# Altium schematic sheet Sheet1.SchDoc
size A4; SheetNumber: 1; SheetTotal: 1; SPICEModelCacheYBLDTPVB: <root> / <DocumentId>YBLDTPVB</DocumentId> / </root>
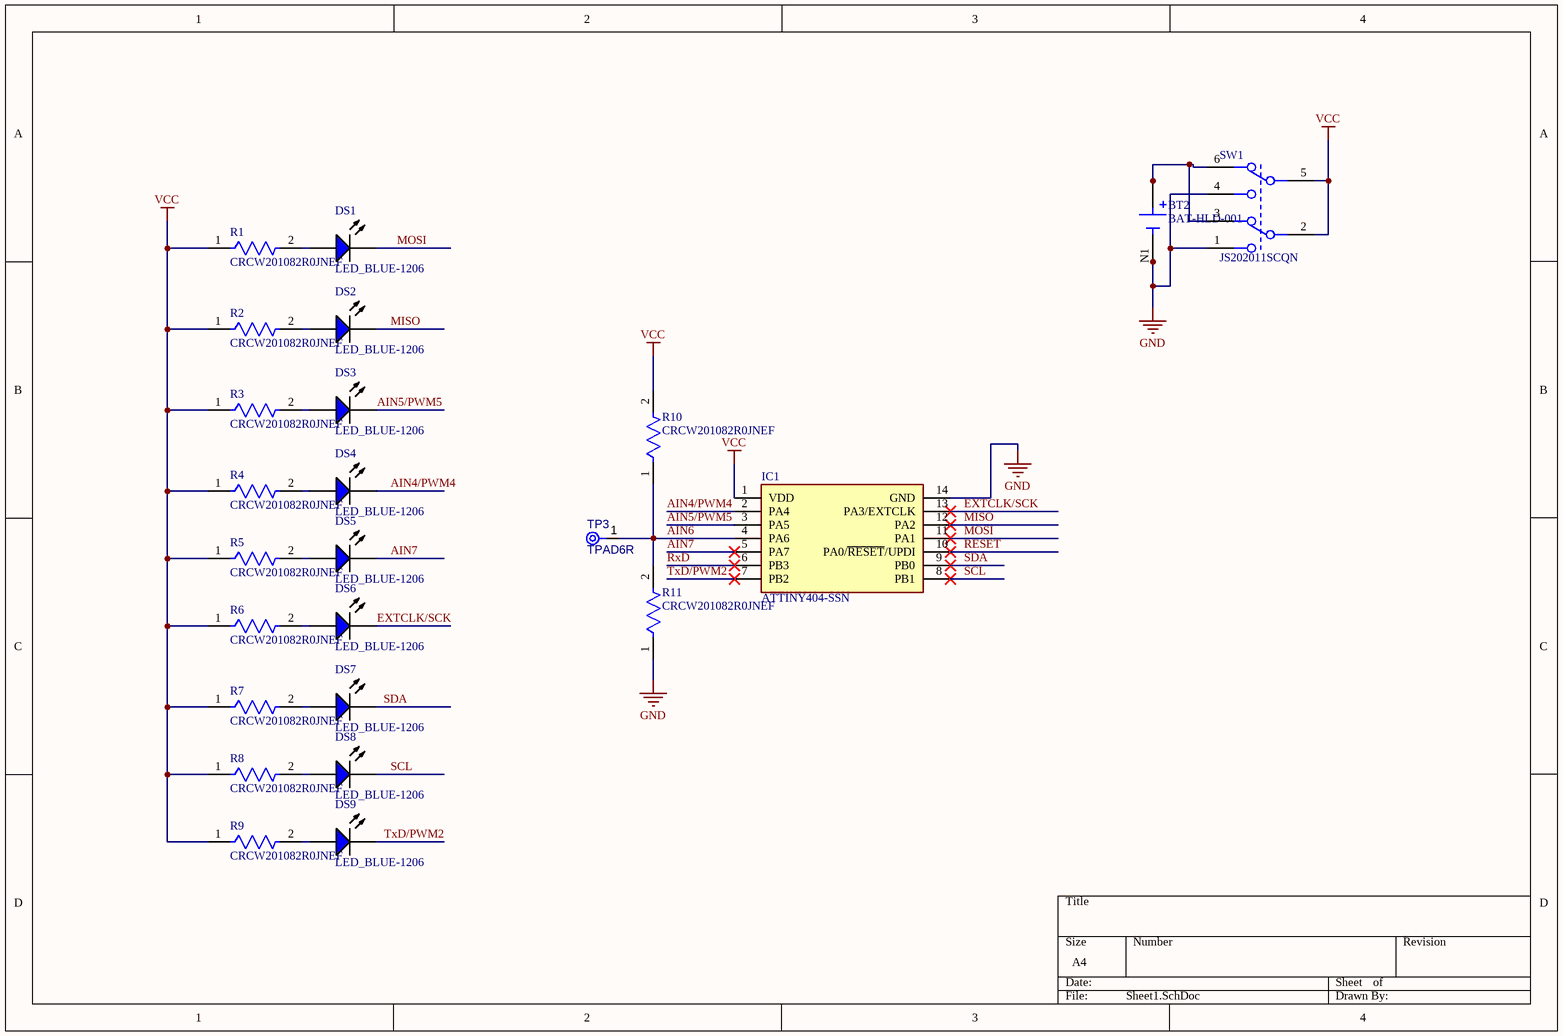
[diagram p0: Sheet1.SchDoc]

## Parts
BT2  BAT-HLD-001  [BAT_BAT-HLD-001]
DS1  LED_BLUE-1206  [LEDC3418X06M]
DS2  LED_BLUE-1206  [LEDC3418X06M]
DS3  LED_BLUE-1206  [LEDC3418X06M]
DS4  LED_BLUE-1206  [LEDC3418X06M]
DS5  LED_BLUE-1206  [LEDC3418X06M]
DS6  LED_BLUE-1206  [LEDC3418X06M]
DS7  LED_BLUE-1206  [LEDC3418X06M]
DS8  LED_BLUE-1206  [LEDC3418X06M]
DS9  LED_BLUE-1206  [LEDC3418X06M]
IC1  ATTINY404-SSN  [SOIC127P600X175-14N]
R1  CRCW201082R0JNEF  [FP-CRCW2010-e3-IPC_A]
R2  CRCW201082R0JNEF  [FP-CRCW2010-e3-IPC_A]
R3  CRCW201082R0JNEF  [FP-CRCW2010-e3-IPC_A]
R4  CRCW201082R0JNEF  [FP-CRCW2010-e3-IPC_A]
R5  CRCW201082R0JNEF  [FP-CRCW2010-e3-IPC_A]
R6  CRCW201082R0JNEF  [FP-CRCW2010-e3-IPC_A]
R7  CRCW201082R0JNEF  [FP-CRCW2010-e3-IPC_A]
R8  CRCW201082R0JNEF  [FP-CRCW2010-e3-IPC_A]
R9  CRCW201082R0JNEF  [FP-CRCW2010-e3-IPC_A]
R10  CRCW201082R0JNEF  [FP-CRCW2010-e3-IPC_A]
R11  CRCW201082R0JNEF  [FP-CRCW2010-e3-IPC_A]
SW1  JS202011SCQN  [FP-JS202011SCQN-MFG]
TP3  TPAD6R  [TP06R]  (no BOM)

## Nets
GND: BT2.N1(NEG) IC1.14(GND) R11.1 SW1.1 SW1.4
VCC: IC1.1(VDD) R1.1 R2.1 R3.1 R4.1 R5.1 R6.1 R7.1 R8.1 R9.1 R10.2 SW1.2 SW1.5
AIN4/PWM4: DS4.2(K) IC1.2(PA4)
AIN5/PWM5: DS3.2(K) IC1.3(PA5)
AIN6: IC1.4(PA6) R10.1 R11.2 TP3.1(TP)
AIN7: DS5.2(K) IC1.5(PA7)
EXTCLK/SCK: DS6.2(K) IC1.13(PA3/EXTCLK)
MISO: DS2.2(K) IC1.12(PA2)
MOSI: DS1.2(K) IC1.11(PA1)
RESET: IC1.10(PA0/~{RESET}/UPDI)
RxD: IC1.6(PB3)
SCL: DS8.2(K) IC1.8(PB1)
SDA: DS7.2(K) IC1.9(PB0)
TxD/PWM2: DS9.2(K) IC1.7(PB2)
NetBT2_P1: BT2.P1(POS) BT2.P2(POS) SW1.3 SW1.6
NetDS1_1: DS1.1(A) R1.2
NetDS2_1: DS2.1(A) R2.2
NetDS3_1: DS3.1(A) R3.2
NetDS4_1: DS4.1(A) R4.2
NetDS5_1: DS5.1(A) R5.2
NetDS6_1: DS6.1(A) R6.2
NetDS7_1: DS7.1(A) R7.2
NetDS8_1: DS8.1(A) R8.2
NetDS9_1: DS9.1(A) R9.2

## Library data of the parts
BT2 = BAT-HLD-001: Battery Retainer Coin, 20.0mm 1 Cell SMD (SMT) Tab; MF: {'manufacturer': u'Linx'}; Availability: Unavailable; Price: None; MP: BAT-HLD-001; Package: None; Value: *
DS1-DS9 = CMP-007-00036-1: Generic LED in 1206 package
IC1 = ATTINY404-SSN: Integrated Circuit; Manufacturer_Name: Microchip; Datasheet Link: https://componentsearchengine.com/Datasheets/2/ATTINY404-SSN.pdf; Height: 1.75mm; Manufacturer_Part_Number: ATTINY404-SSN; Mouser Part Number: 579-ATTINY404-SSN; Mouser Price/Stock: https://www.mouser.co.uk/ProductDetail/Microchip-Technology/ATTINY404-SSN?qs=3HJ2avRr9PJ8OrTjUlXZkg%3D%3D; Arrow Part Number: ATTINY404-SSN; Arrow Price/Stock: https://www.arrow.com/en/products/attiny404-ssn/microchip-technology?region=nac
R1-R11 = CMP-02407-006949-1: RES Thick Film, 82Ω, 5%, 0.75W, 200ppm/°C, 2010; Power Rating: 750mW; Resistance: 82R; Voltage Rating (DC): 400V; Depth: 2.5mm; Max Operating Temperature: 155°C; Length: 5mm; Number of Pins: 2; Weight: 0.000899oz; Package Quantity: 1; Composition: Thick Film; Features: Automotive AEC-Q200; Tolerance: 5%; Contact Plating: Tin; Number of Terminations: 2; Case/Package: 2010; Voltage Rating: 400V; Height: 0.028inch; Width: 2.5mm; Case Code (Metric): 5025; Military Standard: Not; Packaging: Tape and Reel; Radiation Hardening: No; Min Operating Temperature: -55°C; Temperature Coefficient: 200ppm/°C; Lead Free: Lead Free; Case Code (Imperial): 2010; Max Power Dissipation: 750mW
SW1 = CMP-2000-05087-3: SWITCH SLIDE DPDT 300MA 6V; Switch Function: On-On; Actuator Type: Standard; Switch Travel: 2mm; Actuator Color: Black; Contact Resistance: 70mR; Electrical Life: 5000Cycles; Actuator Material: Nylon; REACH SVHC: No SVHC; Series: JS; Min Operating Temperature: -20°C; Depth: 7.5mm; Housing Material: Nylon; Voltage Rating (DC): 6V; Max Operating Temperature: 85°C; Contact Current Rating: 300mA; Package Quantity: 1; Contact Plating: Silver; Contact Material: Copper Alloy; Throw Configuration: DPDT; Current Rating: 300mA; Orientation: Vertical; Max Current Rating: 300mA; Max Voltage Rating (DC): 6V; Flammability Rating: UL94 V-2; Length: 9mm; Packaging: Tape and Reel; Mount: Surface Mount; Actuator Length: 2mm; Lead Free: Lead Free; Termination: Gull Wing; Radiation Hardening: No
TP3 = CMP-00028-00002-1: 0.6mm round; Pins: 1